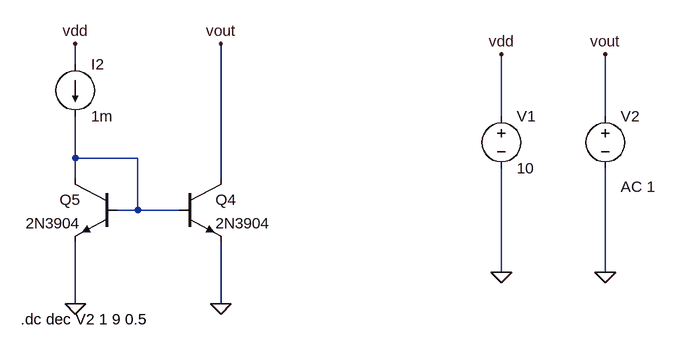
[diagram p0: schematic meros 1o (e).asc]
meros 1o (e).asc, the LTspice schematic file:
Version 4
SHEET 1 992 680
WIRE 96 64 96 32
WIRE 752 144 752 48
WIRE 912 144 912 48
WIRE 96 208 96 144
WIRE 192 208 96 208
WIRE 96 240 96 208
WIRE 320 240 320 32
WIRE 192 288 192 208
WIRE 192 288 160 288
WIRE 256 288 192 288
WIRE 752 384 752 224
WIRE 912 384 912 224
WIRE 96 432 96 336
WIRE 320 432 320 336
FLAG 752 384 0
FLAG 912 384 0
FLAG 320 432 0
FLAG 96 432 0
FLAG 96 32 vdd
FLAG 752 48 vdd
FLAG 320 32 vout
FLAG 912 48 vout
SYMBOL npn 256 240 R0
SYMATTR InstName Q4
SYMATTR Value 2N3904
SYMBOL npn 160 240 M0
SYMATTR InstName Q5
SYMATTR Value 2N3904
SYMBOL current 96 64 R0
WINDOW 123 0 0 Left 0
WINDOW 39 0 0 Left 0
SYMATTR InstName I2
SYMATTR Value 1m
SYMBOL voltage 752 128 R0
WINDOW 123 0 0 Left 0
WINDOW 39 0 0 Left 0
SYMATTR InstName V1
SYMATTR Value 10
SYMBOL voltage 912 128 R0
WINDOW 123 24 124 Left 2
WINDOW 39 0 0 Left 0
SYMATTR Value2 AC 1
SYMATTR InstName V2
SYMATTR Value ""
TEXT 12 456 Left 2 !.dc dec V2 1 9 0.5

The netlist it stands for:
* meros 1o (e).asc
Q4 vout N001 0 0 2N3904
Q5 N001 N001 0 0 2N3904
I2 vdd N001 1m
V1 vdd 0 10
V2 vout 0 AC 1
.model NPN NPN
.model PNP PNP
.lib standard.bjt
.dc dec V2 1 9 0.5
.backanno
.end